# EAGLE design STorM32 NT BGC v620-sd-020 (EAGLE 7.5.0)
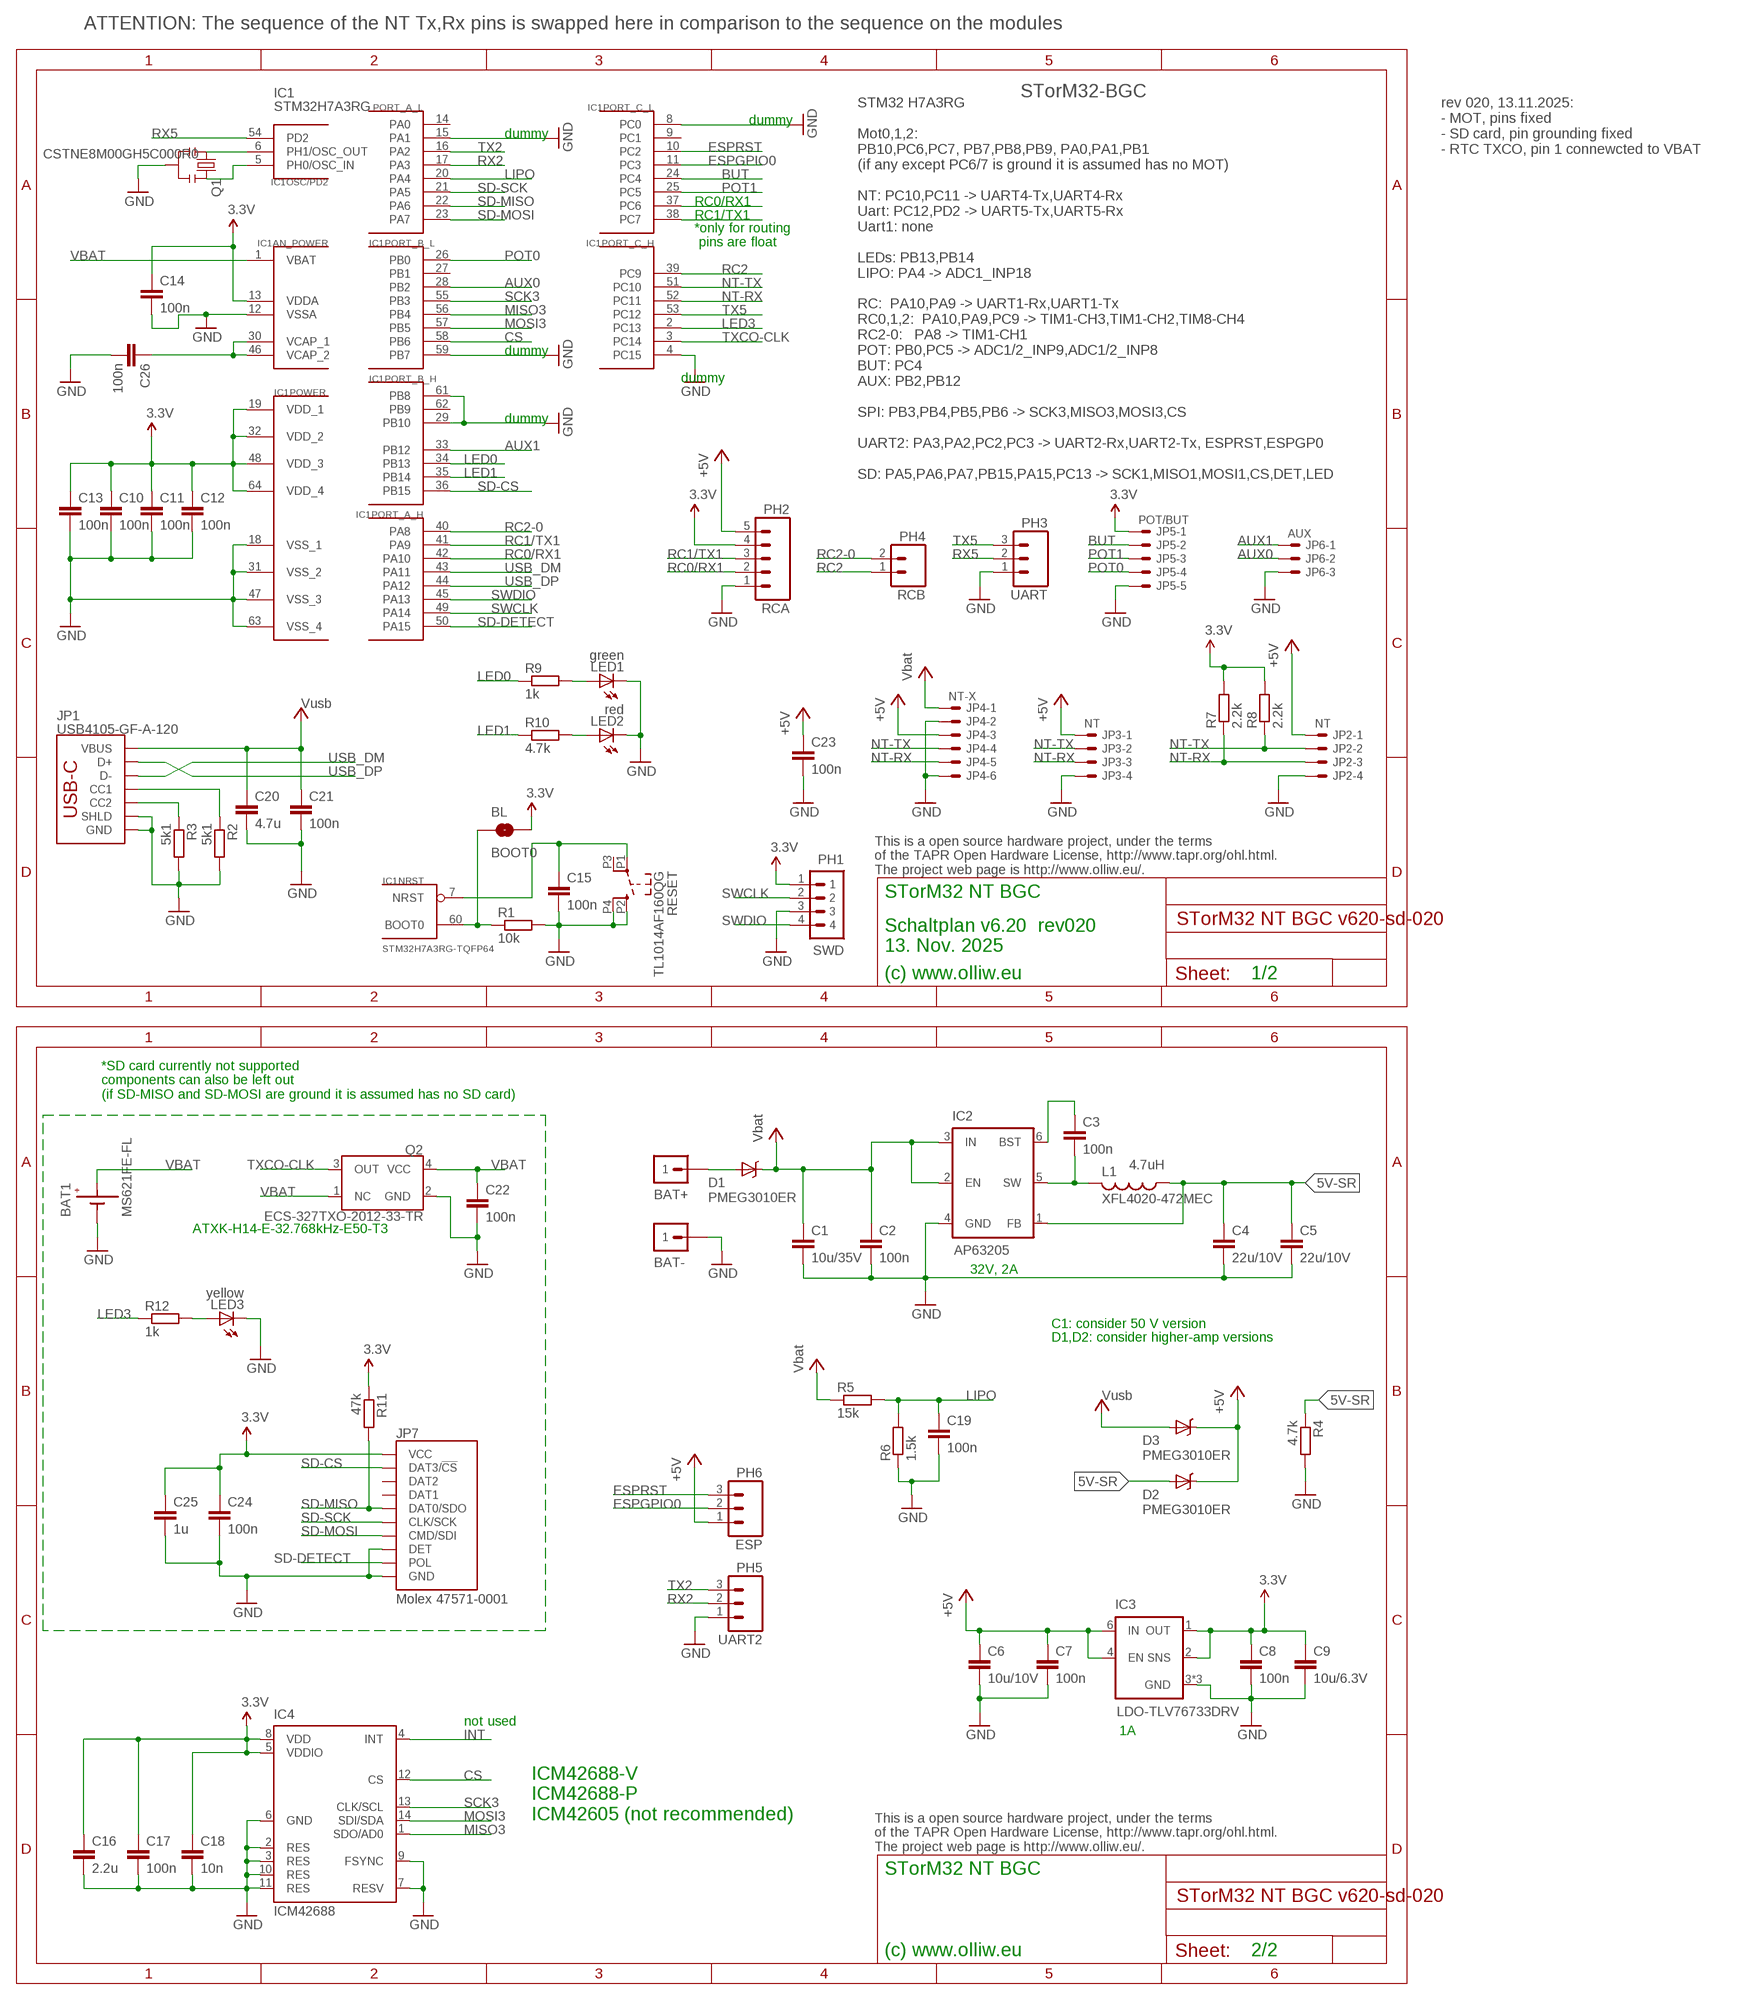
[diagram p0: schematic, sheet 1]

## Parts
BAT1  MS621FE-FL  CELL-SMD-6P8  [CELL-RECHARGABLE-6P8]
BAT+  M1X1  [1X1_WITHOUT]
BAT-  M1X1  [1X1_WITHOUT]
BL  BOOT0  SOLDERJUMPERNO  [SJ_2S-NO]
C1  10u/35V  C-EUC1206K  [C1206K]
C2  100n  C-EUC0603  [C0603]
C3  100n  C-EUC0402  [C0402]
C4  22u/10V  C-EUC0805K  [C0805K]
C5  22u/10V  C-EUC0805K  [C0805K]
C6  10u/10V  C-EUC0805K  [C0805K]
C7  100n  C-EUC0402  [C0402]
C8  100n  C-EUC0402  [C0402]
C9  10u/6.3V  C-EUC0805K  [C0805K]
C10  100n  C-EUC0402  [C0402]
C11  100n  C-EUC0402  [C0402]
C12  100n  C-EUC0402  [C0402]
C13  100n  C-EUC0402  [C0402]
C14  100n  C-EUC0402  [C0402]
C15  100n  C-EUC0402  [C0402]
C16  2.2u  C-EUC0603  [C0603]
C17  100n  C-EUC0402  [C0402]
C18  10n  C-EUC0402  [C0402]
C19  100n  C-EUC0402  [C0402]
C20  4.7u  C-EUC0603  [C0603]
C21  100n  C-EUC0402  [C0402]
C22  100n  C-EUC0402  [C0402]
C23  100n  C-EUC0402  [C0402]
C24  100n  C-EUC0402  [C0402]
C25  1u  C-EUC0402  [C0402]
C26  100n  C-EUC0402  [C0402]
D1  PMEG3010ER  DIODE-SCHOTTKYSOD123-W  [SOD123W-DIODE]
D2  PMEG3010ER  DIODE-SCHOTTKYSOD123-W  [SOD123W-DIODE]
D3  PMEG3010ER  DIODE-SCHOTTKYSOD123-W  [SOD123W-DIODE]
IC1  STM32H7A3RG-TQFP64  STM32H7A3-TQFP64  [TQFP64]
IC2  AP63205  [SOT23-6]
IC3  LDO-TLV76733DRV  LDO-TLV767  [WSON-6-2X2]
IC4  ICM42688  ICM42605  [LGA14-2.5X3]
JP1  USB4105-GF-A-120  USB-C  [USB-C]
JP2  NT  SM04B-SRSS-TB  [SM04B-SRSS-TB]
JP3  NT  SM04B-SRSS-TB  [SM04B-SRSS-TB]
JP4  NT-X  SM06B-SRSS-TB  [SM06B-SRSS-TB]
JP5  POT/BUT  SM05B-SRSS-TB  [SM05B-SRSS-TB]
JP6  AUX  SM03B-SRSS-TB  [SM03B-SRSS-TB]
JP7  Molex 47571-0001  SD-MICRO-DFT  [SD-MICRO-SHORT]
L1  XFL4020-472MEC  L  [L4X4]
LED1  green  LEDCHIPLED_0603  [CHIPLED_0603]
LED2  red  LEDCHIPLED_0603  [CHIPLED_0603]
LED3  yellow  LEDCHIPLED_0603  [CHIPLED_0603]
PH1  SWD  P4X1_1P27-OCT_BILEX  [4X1_1P27_OCT_BILEX]
PH2  RCA  M05PTH  [1X05]
PH3  UART  M031X03_NO_SILK  [1X03_NO_SILK]
PH4  RCB  M021X02_NO_SILK  [1X02_NO_SILK]
PH5  UART2  M031X03_NO_SILK  [1X03_NO_SILK]
PH6  ESP  M031X03_NO_SILK  [1X03_NO_SILK]
Q1  CSTNE8M00GH5C000R0  RESONATORSMD  [RESONATOR-SMD]
Q2  ECS-327TXO-2012-33-TR  TXCO-2.0X1.2MM  [TXCO-20X12]
R1  10k  R-EU_R0402  [R0402]
R2  5k1  R-EU_R0402  [R0402]
R3  5k1  R-EU_R0402  [R0402]
R4  4.7k  R-EU_R0402  [R0402]
R5  15k  R-EU_R0402  [R0402]
R6  1.5k  R-EU_R0402  [R0402]
R7  2.2k  R-EU_R0402  [R0402]
R8  2.2k  R-EU_R0402  [R0402]
R9  1k  R-EU_R0402  [R0402]
R10  4.7k  R-EU_R0402  [R0402]
R11  47k  R-EU_R0402  [R0402]
R12  1k  R-EU_R0402  [R0402]
RESET  TL1014AF160QG  SWITCH-SMD-RIGHT-TL1014  [TACTILE-SWITCH-SMD-RIGHT-TL1014]

## Nets
3.3V: BL.2 C8.1 C9.1 C10.1 C11.1 C12.1 C13.1 C14.1 C16.1 C17.1 C18.1 C24.1 C25.1 IC1.13(AN_POWER:VDDA) IC1.19(POWER:VDD_1) IC1.32(POWER:VDD_2) IC1.48(POWER:VDD_3) IC1.64(POWER:VDD_4) IC3.1(OUT) IC3.2(SNS) IC4.5(VDDIO) IC4.8(VDD) JP5.1 JP7.4(VCC) PH1.1 PH2.4 R7.2 R8.2 R11.1
5V-SR: C4.1 C5.1 D2.A IC2.1(FB) L1.1 R4.1
+5V: C6.1 C7.1 C23.1 D2.C D3.C IC3.4(EN) IC3.6(IN) JP2.1 JP3.1 JP4.3 PH2.5 PH6.1
AUX0: IC1.28(PORT_B_L:PB2) JP6.2
AUX1: IC1.33(PORT_B_H:PB12) JP6.1
BATP: BAT+.1 D1.A
BOOT0: BL.1 IC1.60(NRST:BOOT0) R1.1
BUT: IC1.24(PORT_C_L:PC4) JP5.2
CS: IC1.58(PORT_B_L:PB6) IC4.12(CS)
ESPGPIO0: IC1.11(PORT_C_L:PC3) PH6.2
ESPRST: IC1.10(PORT_C_L:PC2) PH6.3
GND: BAT1.P-(GND) BAT-.1 C1.2 C2.2 C4.2 C5.2 C6.2 C7.2 C8.2 C9.2 C10.2 C11.2 C12.2 C13.2 C14.2 C15.2 C16.2 C17.2 C18.2 C19.2 C20.2 C21.2 C22.2 C23.2 C24.2 C25.2 C26.2 IC1.4(PORT_C_H:PC15) IC1.8(PORT_C_L:PC0) IC1.12(AN_POWER:VSSA) IC1.15(PORT_A_L:PA1) IC1.18(POWER:VSS_1) IC1.29(PORT_B_H:PB10) IC1.31(POWER:VSS_2) IC1.47(POWER:VSS_3) IC1.59(PORT_B_L:PB7) IC1.61(PORT_B_H:PB8) IC1.63(POWER:VSS_4) IC2.4(GND) IC3.3(GND) IC3.5(GND) IC3.7(GND) IC4.2(RES) IC4.3(RES) IC4.6(GND) IC4.7(RESV) IC4.9(FSYNC) IC4.10(RES) IC4.11(RES) JP1.GND JP1.GND2(GND) JP1.SHLD1(SHLD) JP1.SHLD2(SHLD) JP1.SHLD3(SHLD) JP1.SHLD4(SHLD) JP2.4 JP3.4 JP4.2 JP4.6 JP5.5 JP6.3 JP7.6(GND) JP7.G4(DET) JP7.GND1(GND) JP7.GND2(GND) LED1.C LED2.C LED3.C PH1.3 PH2.1 PH3.1 PH5.1 Q1.2 Q2.2(GND) R1.2 R2.2 R3.2 R4.2 R6.1 RESET.P2 RESET.P4
INT: IC4.4(INT)
LED0: IC1.34(PORT_B_H:PB13) R9.1
LED1: IC1.35(PORT_B_H:PB14) R10.1
LED3: IC1.2(PORT_C_H:PC13) R12.1
LIPO: C19.1 IC1.20(PORT_A_L:PA4) R5.2 R6.2
MISO3: IC1.56(PORT_B_L:PB4) IC4.1(SDO/AD0)
MOSI3: IC1.57(PORT_B_L:PB5) IC4.14(SDI/SDA)
N$3: IC1.5(OSC/PD2:PH0/OSC_IN) Q1.3
N$4: LED3.A R12.2
N$8: LED1.A R9.2
N$9: LED2.A R10.2
N$10: JP1.A5(CC1) R2.1
N$11: JP1.B5(CC2) R3.1
N$12: IC1.6(OSC/PD2:PH1/OSC_OUT) Q1.1
N$13: C3.1 IC2.6(BST)
N$15: C3.2 IC2.5(SW) L1.2
NRST: C15.1 IC1.7(NRST:NRST) RESET.P1
NT-RX: IC1.52(PORT_C_H:PC11) JP2.3 JP3.3 JP4.5 R7.1
NT-TX: IC1.51(PORT_C_H:PC10) JP2.2 JP3.2 JP4.4 R8.1
POT0: IC1.26(PORT_B_L:PB0) JP5.4
POT1: IC1.25(PORT_C_L:PC5) JP5.3
RC0/RX1: IC1.37(PORT_C_L:PC6) IC1.42(PORT_A_H:PA10) PH2.2
RC1/TX1: IC1.38(PORT_C_L:PC7) IC1.41(PORT_A_H:PA9) PH2.3
RC2: IC1.39(PORT_C_H:PC9) PH4.1
RC2-0: IC1.40(PORT_A_H:PA8) PH4.2
RX2: IC1.17(PORT_A_L:PA3) PH5.2
RX5: IC1.54(OSC/PD2:PD2) PH3.2
SCK3: IC1.55(PORT_B_L:PB3) IC4.13(CLK/SCL)
SD-CS: IC1.36(PORT_B_H:PB15) JP7.2(DAT3/!CS!)
SD-DETECT: IC1.50(PORT_A_H:PA15) JP7.G3(POL)
SD-MISO: IC1.22(PORT_A_L:PA6) JP7.7(DAT0/SDO) R11.2
SD-MOSI: IC1.23(PORT_A_L:PA7) JP7.3(CMD/SDI)
SD-SCK: IC1.21(PORT_A_L:PA5) JP7.5(CLK/SCK)
SWCLK: IC1.49(PORT_A_H:PA14) PH1.2
SWDIO: IC1.45(PORT_A_H:PA13) PH1.4
TX2: IC1.16(PORT_A_L:PA2) PH5.3
TX5: IC1.53(PORT_C_H:PC12) PH3.3
TXCO-CLK: IC1.3(PORT_C_H:PC14) Q2.3(OUT)
USB_DM: IC1.43(PORT_A_H:PA11) JP1.A7(D-) JP1.B7(D-)
USB_DP: IC1.44(PORT_A_H:PA12) JP1.A6(D+) JP1.B6(D+)
VBAT: BAT1.P+(BAT+) C22.1 IC1.1(AN_POWER:VBAT) Q2.1(NC) Q2.4(VCC)
VCAP_1: C26.1 IC1.30(AN_POWER:VCAP_1) IC1.46(AN_POWER:VCAP_2)
VCC: C1.1 C2.1 D1.C IC2.2(EN) IC2.3(IN) JP4.1 R5.1 ; supply symbol labelled Vbat
VUSB: C20.1 C21.1 D3.A JP1.VBUS1(VBUS) JP1.VBUS2(VBUS) ; supply symbol labelled Vusb
Unconnected: IC1.9(PORT_C_L:PC1) IC1.14(PORT_A_L:PA0) IC1.27(PORT_B_L:PB1) IC1.62(PORT_B_H:PB9) JP7.1(DAT2) JP7.8(DAT1) RESET.P3

## Notes on the sheet
- ATTENTION: The sequence of the NT Tx,Rx pins is swapped here in comparison to the sequence on the modules
- IC1
- STM32 H7A3RG
  
  Mot0,1,2:
  PB10,PC6,PC7, PB7,PB8,PB9, PA0,PA1,PB1
  (if any except PC6/7 is ground it is assumed has no MOT)
  
  NT: PC10,PC11 -> UART4-Tx,UART4-Rx
  Uart: PC12,PD2 -> UART5-Tx,UART5-Rx
  Uart1: none
  
  LEDs: PB13,PB14
  LIPO: PA4 -> ADC1_INP18
  
  RC:  PA10,PA9 -> UART1-Rx,UART1-Tx
  RC0,1,2:  PA10,PA9,PC9 -> TIM1-CH3,TIM1-CH2,TIM8-CH4
  RC2-0:   PA8 -> TIM1-CH1
  POT: PB0,PC5 -> ADC1/2_INP9,ADC1/2_INP8
  BUT: PC4
  AUX: PB2,PB12
  
  SPI: PB3,PB4,PB5,PB6 -> SCK3,MISO3,MOSI3,CS
  
  UART2: PA3,PA2,PC2,PC3 -> UART2-Rx,UART2-Tx, ESPRST,ESPGP0
  
  SD: PA5,PA6,PA7,PB15,PA15,PC13 -> SCK1,MISO1,MOSI1,CS,DET,LED
- STorM32-BGC
- rev 020, 13.11.2025:
  - MOT, pins fixed
  - SD card, pin grounding fixed
  - RTC TXCO, pin 1 connewcted to VBAT
- STM32H7A3RG
- dummy
- dummy
- *only for routing
   pins are float
- dummy
- dummy
- dummy
- This is a open source hardware project, under the terms
  of the TAPR Open Hardware License, http://www.tapr.org/ohl.html.
  The project web page is http://www.olliw.eu/.
- STorM32 NT BGC
- Schaltplan v6.20  rev020
  13. Nov. 2025
- (c) www.olliw.eu | 1/2
- *SD card currently not supported
   components can also be left out
   (if SD-MISO and SD-MOSI are ground it is assumed has no SD card)
- 4.7uH
- ATXK-H14-E-32.768kHz-E50-T3
- 32V, 2A
- C1: consider 50 V version
- D1,D2: consider higher-amp versions
- not used | 1A
- ICM42688-V
  ICM42688-P
  ICM42605 (not recommended)
- This is a open source hardware project, under the terms
  of the TAPR Open Hardware License, http://www.tapr.org/ohl.html.
  The project web page is http://www.olliw.eu/.
- STorM32 NT BGC
- (c) www.olliw.eu | 2/2

## Library data of the parts
BAT1 = # stdlib:CELL
BAT+ BAT- = # stdlib:M1X1
BL = # SparkFun2:SOLDERJUMPER: Solder Jumper Standard SMD solder jumper. Used to automate production. Two varients : Normally Open and Normally Closed are the same, but have different paste layers. NC will have a large amount of paste and should jumper during reflow.
C1-C26 = rcl:C-EU: CAPACITOR, European symbol
D1-D3 = # stdlib:DIODE-SCHOTTKY
IC1 = # stm32:STM32H7A3
IC2 = # stdlib:AP63205
IC3 = # stdlib:LDO-TLV767
IC4 = # stdlib:ICM42605
JP1 = # stdlib:USB
JP2 JP3 = con-jst2:?M04B-SRSS-TB: Disconnectable Crimp style connector, 1.0mm pitch 4 contacts
JP4 = con-jst2:?M06B-SRSS-TB: Disconnectable Crimp style connector, 1.0mm pitch 6 contacts
JP5 = con-jst2:?M05B-SRSS-TB: Disconnectable Crimp style connector, 1.0mm pitch 5 contacts
JP6 = con-jst2:?M03B-SRSS-TB: Disconnectable Crimp style connector, 1.0mm pitch 3 contacts
JP7 = # stdlib:SD-MICRO
L1 = # stdlib:L
LED1-LED3 = led:LED: LED OSRAM: - CHIPLED LG R971, LG N971, LY N971, LG Q971, LY Q971, LO R971, LY R971 LH N974, LH R974 LS Q976, LO Q976, LY Q976 LO Q996 - Hyper CHIPLED LW Q18S LB Q993, LB Q99A, LB R99A - SideLED LS A670, LO A670, LY A670, LG A670, LP A670 LB A673, LV A673, LT A673, LW A673 LH A674 LY A675 LS A676, LA A676, LO A676, LY A676, LW A676 LS A679, LY A679, LG A679 - Hyper Micro SIDELED® LS Y876, LA Y876, LO Y876, LY Y876 LT Y87S - SmartLED LW L88C, LW L88S LB L89C, LB L89S, LG L890 LS L89K, LO L89K, LY L89K LS L896, LA L896, LO L896, LY L896 - TOPLED LS T670, LO T670, LY T670, LG T670, LP T670 LSG T670, LSP T670, LSY T670, LOP T670, LYG T670 LG T671, LOG T671, LSG T671 LB T673, LV T673, LT T673, LW T673 LH T674 LS T676, LA T676, LO T676, LY T676, LB T676, LH T676, LSB T676, LW T676 LB T67C, LV T67C, LT T67C, LS T67K, LO T67K, LY T67K, LW E67C LS E67B, LA E67B, LO E67B, LY E67B, LB E67C, LV E67C, LT E67C LW T67C LS T679, LY T679, LG T679 LS T770, LO T770, LY T770, LG T770, LP T770 LB T773, LV T773, LT T773, LW T773 LH T774 LS E675, LA E675, LY E675, LS T675 LS T776, LA T776, LO T776, LY T776, LB T776 LHGB T686 LT T68C, LB T68C - Hyper Mini TOPLED® LB M676 - Mini TOPLED Santana® LG M470 LS M47K, LO M47K, LY M47K Source: http://www.osram.convergy.de LUXEON: - LUMILED® LXK2-PW12-R00, LXK2-PW12-S00, LXK2-PW14-U00, LXK2-PW14-V00 LXK2-PM12-R00, LXK2-PM12-S00, LXK2-PM14-U00 LXK2-PE12-Q00, LXK2-PE12-R00, LXK2-PE12-S00, LXK2-PE14-T00, LXK2-PE14-U00 LXK2-PB12-K00, LXK2-PB12-L00, LXK2-PB12-M00, LXK2-PB14-N00, LXK2-PB14-P00, LXK2-PB14-Q00 LXK2-PR12-L00, LXK2-PR12-M00, LXK2-PR14-Q00, LXK2-PR14-R00 LXK2-PD12-Q00, LXK2-PD12-R00, LXK2-PD12-S00 LXK2-PH12-R00, LXK2-PH12-S00 LXK2-PL12-P00, LXK2-PL12-Q00, LXK2-PL12-R00 Source: www.luxeon.com KINGBRIGHT: KA-3528ASYC Source: www.kingbright.com
PH1 = # stdlib:P4X1_1P27
PH2 = # SparkFun2:M05: Header 5 Standard 5-pin 0.1" header. Use with straight break away headers (SKU : PRT-00116), right angle break away headers (PRT-00553), swiss pins (PRT-00743), machine pins (PRT-00117), and female headers (PRT-00115). Molex polarized connector foot print use with SKU : PRT-08230 with associated crimp pins and housings.
PH3 PH5 PH6 = # SparkFun2:M03: Header 3 Standard 3-pin 0.1" header. Use with straight break away headers (SKU : PRT-00116), right angle break away headers (PRT-00553), swiss pins (PRT-00743), machine pins (PRT-00117), and female headers (PRT-00115). Molex polarized connector foot print use with SKU : PRT-08232 with associated crimp pins and housings.
PH4 = # SparkFun2:M02: Header 2 Standard 2-pin 0.1" header. Use with straight break away headers (SKU : PRT-00116), right angle break away headers (PRT-00553), swiss pins (PRT-00743), machine pins (PRT-00117), and female headers (PRT-00115). Molex polarized connector foot print use with SKU : PRT-08233 with associated crimp pins and housings.
Q1 = # SparkFun2:RESONATOR: Resonator Small SMD resonator. This is the itty bitty 10/20MHz resonators with built in caps. CSTCE10M0G55 and CSTCE20M0V53. Footprint has been reviewed closely but hasn't been tested yet.
Q2 = # stdlib:TXCO
R1-R12 = rcl:R-EU_: RESISTOR, European symbol
RESET = # stdlib:SWITCH-SMD-RIGHT-TL1014

## Board
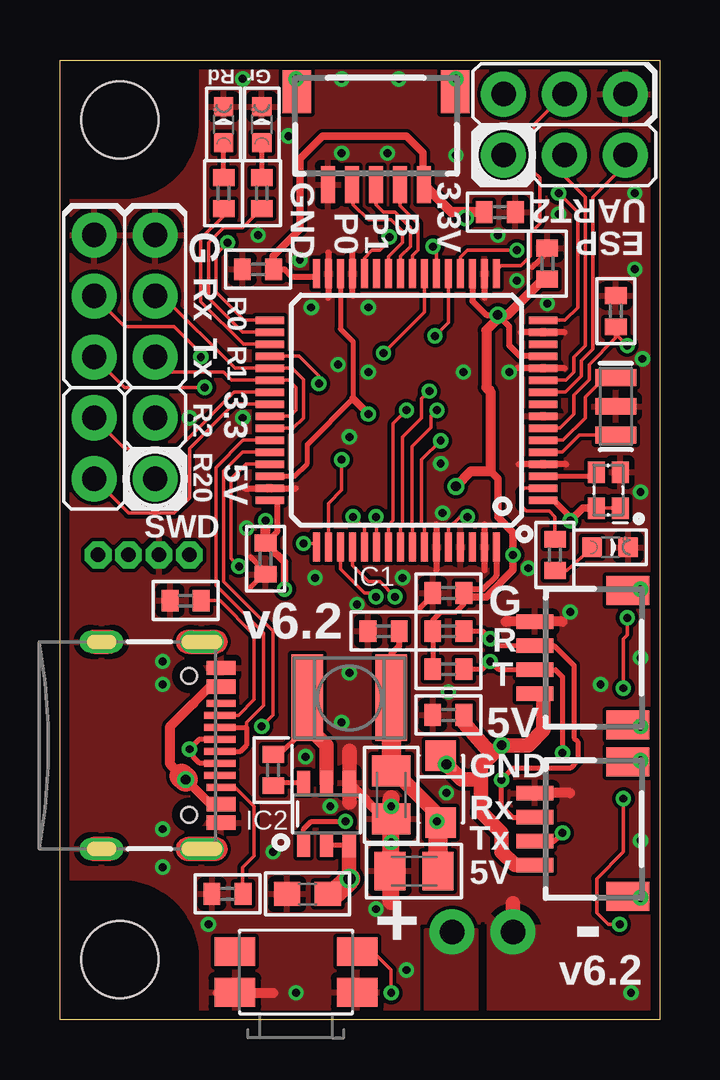
[diagram p1: board, top side]
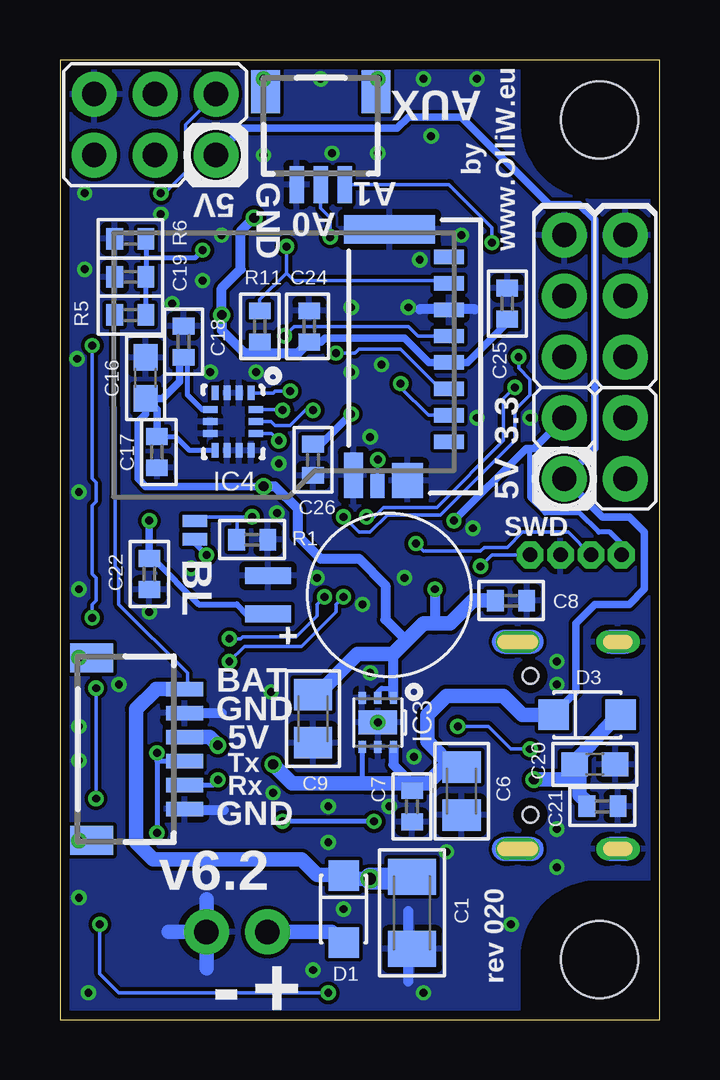
[diagram p2: board, bottom side, seen from below]

Size 25 x 40 mm. Coordinates in mm from the lower left corner, seen from the top.
Outline: 25,0 0,0 0,40 25,40 25,0
Copper layers (1*16): Top 0.035mm / dielectric 1.5mm / Bottom 0.035mm
Design rules "ShenZhen2U_2layer_EagleRules *": minimum track width 6mil, minimum drill 12mil, track to track 6mil, track to pad 6mil, pad to pad 6mil, via to via 6mil, smd to smd 0mil, copper to edge 15mil, drill to drill 10mil, minimum pad ring 10mil, minimum via ring 6mil, stop-mask expansion 2mil, vias tented up to drill 25mil, thermal gap 10mil
Holes 3.2 mm at 2.5,2.5 2.5,37.5
tRestrict: area 17.7,0.3 to 17.8,4

### Footprints (pad centres in the part's own frame; a part is rotated, then mirrored left to right if it is on the bottom)
CELL-RECHARGABLE-6P8 = smd 1.9 x 0.7: P+ 5.05,0.8; P- 5.05,-0.8
1X1_WITHOUT = drill 1.016 pad 1.88: 1 0,0
SJ_2S-NO = smd 0.508 x 1.016: 1 -0.381,0; 2 0.381,0
C1206K = smd 1.5 x 2: 1 -1.5,0; 2 1.5,0
C0603 = smd 1.1 x 1: 1 -0.85,0; 2 0.85,0
C0402 = smd 0.7 x 0.9: 1 -0.65,0; 2 0.65,0
C0805K = smd 1.3 x 1.6: 1 -1,0; 2 1,0
SOD123W-DIODE = smd 1.27 x 1.27: A -1.4,0; C 1.4,0
TQFP64 = smd 1.2 x 0.3: 1 -5.7,3.75; 2 -5.7,3.25; 3 -5.7,2.75; 4 -5.7,2.25; 5 -5.7,1.75; 6 -5.7,1.25; 7 -5.7,0.75; 8 -5.7,0.25; 9 -5.7,-0.25; 10 -5.7,-0.75; 11 -5.7,-1.25; 12 -5.7,-1.75; 13 -5.7,-2.25; 14 -5.7,-2.75; 15 -5.7,-3.25; 16 -5.7,-3.75; 33 5.7,-3.75; 34 5.7,-3.25; 35 5.7,-2.75; 36 5.7,-2.25; 37 5.7,-1.75; 38 5.7,-1.25; 39 5.7,-0.75; 40 5.7,-0.25; 41 5.7,0.25; 42 5.7,0.75; 43 5.7,1.25; 44 5.7,1.75; 45 5.7,2.25; 46 5.7,2.75; 47 5.7,3.25; 48 5.7,3.75 | smd 0.3 x 1.2: 17 -3.75,-5.7; 18 -3.25,-5.7; 19 -2.75,-5.7; 20 -2.25,-5.7; 21 -1.75,-5.7; 22 -1.25,-5.7; 23 -0.75,-5.7; 24 -0.25,-5.7; 25 0.25,-5.7; 26 0.75,-5.7; 27 1.25,-5.7; 28 1.75,-5.7; 29 2.25,-5.7; 30 2.75,-5.7; 31 3.25,-5.7; 32 3.75,-5.7; 49 3.75,5.7; 50 3.25,5.7; 51 2.75,5.7; 52 2.25,5.7; 53 1.75,5.7; 54 1.25,5.7; 55 0.75,5.7; 56 0.25,5.7; 57 -0.25,5.7; 58 -0.75,5.7; 59 -1.25,5.7; 60 -1.75,5.7; 61 -2.25,5.7; 62 -2.75,5.7; 63 -3.25,5.7; 64 -3.75,5.7
SOT23-6 = smd 0.55 x 0.99: 1 -0.95,-1.3; 2 0,-1.3; 3 0.95,-1.3; 4 0.95,1.3; 5 0,1.3; 6 -0.95,1.3
WSON-6-2X2 = smd 0.5 x 0.3: 1 -1.025,0.65; 2 -1.025,0; 3 -1.025,-0.65; 4 1.025,-0.65; 5 1.025,0; 6 1.025,0.65 | smd 1 x 1.6: 7 0,0
LGA14-2.5X3 = smd 0.6 x 0.3: 1 -1.2,0.75; 2 -1.2,0.25; 3 -1.2,-0.25; 4 -1.2,-0.75; 8 1.2,-0.75; 9 1.2,-0.25; 10 1.2,0.25; 11 1.2,0.75 | smd 0.3 x 0.6: 5 -0.5,-0.95; 6 0,-0.95; 7 0.5,-0.95; 12 0.5,0.95; 13 0,0.95; 14 -0.5,0.95
USB-C = smd 0.3 x 1.3: A5 -1.25,3.65; A6 -0.25,3.65; A7 0.25,3.65; A8 1.25,3.65; B6 0.75,3.65; B7 -0.75,3.65 | smd 0.3 x 1.2: B5 1.75,3.7; B8 -1.75,3.7 | smd 0.6 x 1.2: GND -3.225,3.7; GND2 3.225,3.7; VBUS1 -2.45,3.7; VBUS2 2.45,3.7 | drill 0.4 pad 0.6 long: SHLD1 -4.318,2.895; SHLD2 4.318,2.895; SHLD3 -4.318,-1.285; SHLD4 4.318,-1.285 | hole 0.65: -2.89,2.365; 2.89,2.365
SM04B-SRSS-TB = smd 0.6 x 1.55: 1 -1.5,2.975; 2 -0.5,2.975; 3 0.5,2.975; 4 1.5,2.975 | smd 1.2 x 1.8: FIT@1 -2.8,-0.9; FIT@2 2.8,-0.9
SM06B-SRSS-TB = smd 0.6 x 1.55: 1 -2.5,2.975; 2 -1.5,2.975; 3 -0.5,2.975; 4 0.5,2.975; 5 1.5,2.975; 6 2.5,2.975 | smd 1.2 x 1.8: FIT@1 -3.8,-0.9; FIT@2 3.8,-0.9
SM05B-SRSS-TB = smd 0.6 x 1.55: 1 -2,2.975; 2 -1,2.975; 3 0,2.975; 4 1,2.975; 5 2,2.975 | smd 1.2 x 1.8: FIT@1 -3.3,-0.9; FIT@2 3.3,-0.9
SM03B-SRSS-TB = smd 0.6 x 1.55: 1 -1,2.975; 2 0,2.975; 3 1,2.975 | smd 1.2 x 1.8: FIT@1 -2.3,-0.9; FIT@2 2.3,-0.9
SD-MICRO-SHORT = smd 0.6 x 1.25: 1 3.85,-1.325; 2 2.75,-1.325; 3 1.65,-1.325; 4 0.55,-1.325; 5 -0.55,-1.325; 6 -1.65,-1.325; 7 -2.75,-1.325; 8 -3.85,-1.325 | smd 1 x 0.6: G3 5.7,-4.3 | smd 1.9 x 0.8: G4 5.25,-5.3 | smd 1.2 x 3.8: GND1 -5,-3.8 | smd 1.45 x 1.3: GND2 5.475,-3.05
L4X4 = smd 1.3 x 3.6: 1 -1.75,0; 2 1.75,0
CHIPLED_0603 = smd 0.8 x 0.8: A 0,-0.75; C 0,0.75
4X1_1P27_OCT_BILEX = drill 0.61 pad 1.118 octagon: 1 0,0; 2 0,-1.27; 3 0,-2.54; 4 0,-3.81
1X05 = drill 1.016 pad 1.88: 1 0,0; 2 2.54,0; 3 5.08,0; 4 7.62,0; 5 10.16,0
1X03_NO_SILK = drill 1.016 pad 1.88: 1 0,0; 2 2.54,0; 3 5.08,0
1X02_NO_SILK = drill 1.016 pad 1.88: 1 0,0; 2 2.54,0
RESONATOR-SMD = smd 0.7 x 1.7: 1 -1.2,0; 2 0,0; 3 1.2,0
TXCO-20X12 = smd 0.7 x 0.9: 1 -0.5,0.75; 2 -0.5,-0.75; 3 0.5,-0.75; 4 0.5,0.75
R0402 = smd 0.7 x 0.9: 1 -0.65,0; 2 0.65,0
TACTILE-SWITCH-SMD-RIGHT-TL1014 = smd 1.7 x 1.2: P1 2.55,0.85; P2 2.55,-0.85; P3 -2.55,0.85; P4 -2.55,-0.85

### Placement (x,y rotation side)
BAT1  11.27,17.7 180 bottom
BAT+  16.35,3.65 90 top
BAT-  18.89,3.65 0 top
BL  19.37,20.4 270 bottom
C1  10.32,4.45 270 bottom
C2  10.32,5.24 180 top
C3  8.89,10.4 90 top
C4  14.76,6.19 180 top
C5  13.81,9.37 270 top
C6  8.26,9.53 270 bottom
C7  10.32,8.89 270 bottom
C8  6.19,17.46 0 bottom
C9  14.45,12.54 270 bottom
C10  16.19,17.78 180 top
C11  8.26,31.27 180 top
C12  8.57,19.21 270 top
C13  20.32,31.51 90 top
C14  18.34,33.66 0 top
C15  23.18,29.53 90 top
C16  21.43,26.75 90 bottom
C17  20.95,23.65 270 bottom
C18  19.84,28.26 90 bottom
C19  22.07,30.96 180 bottom
C20  2.7,10.64 0 bottom
C21  2.38,8.89 0 bottom
C22  21.27,18.57 270 bottom
C23  16.19,12.7 180 top
C24  14.6,28.89 90 bottom
C25  6.35,29.84 90 bottom
C26  14.45,23.34 270 bottom
D1  13.18,4.6 90 bottom
D2  15.87,9.6 90 top
D3  3.02,12.7 180 bottom
IC1  14.45,25.4 180 top
IC2  11.11,8.57 0 top
IC3  11.75,12.38 270 bottom
IC4  17.78,24.92 270 bottom
JP1  3.02,11.43 270 top
JP2  22.78,7.94 90 top
JP3  22.78,15.08 90 top
JP4  22.78,11.27 270 bottom
JP5  13.18,37.78 180 top
JP6  14.13,37.78 180 bottom
JP7  7.46,27.94 270 bottom
L1  12.06,13.41 180 top
LED1  8.41,37.31 0 top
LED2  6.83,37.31 0 top
LED3  22.94,19.68 270 top
PH1  1.59,19.37 90 top
PH2  3.97,32.7 270 top
PH3  1.43,32.7 270 top
PH4  1.43,25.08 270 top
PH5  23.57,38.58 180 top
PH6  18.49,36.04 0 top
Q1  23.18,25.56 270 top
Q2  22.86,22.07 180 top
R1  16.99,20 0 bottom
R2  5.24,17.46 180 top
R3  6.98,5.24 180 top
R4  13.49,16.19 180 top
R5  22.07,29.37 0 bottom
R6  22.07,32.54 0 bottom
R7  16.19,16.19 180 top
R8  16.19,14.61 180 top
R9  8.41,34.45 90 top
R10  6.83,34.45 90 top
R11  16.67,28.89 90 bottom
R12  20.64,19.37 270 top
RESET  9.84,1.98 0 top

### Tracks (layer width: path | path; a pad name or v marks a point on that pad's centre or on a via)
3.3V  (via drill 0.33, 0.4)
  Top 0.152: 15.15,34.87 JP5.1 | IC1.48 8.88,21.65 9.05,21.64
  Top 0.203: R8.2 R7.2 15.54,16.65 15.87,16.99 16.51,16.99 16.84,17.32 C10.1 | C11.1 8.9,31.42 8.89,31.43
  Top 0.254: 8.89,31.43 8.89,31.29 C11.1 9.37,31.27 9.68,30.96 10.7,30.96 IC1.32 | 9.05,21.64 9.05,20.32 8.57,19.84 | C10.1 16.84,17.8 16.99,17.94 17.64,17.94 18.2,18.5 IC1.64 | IC1.19 17.2,29.95 17.78,29.37 v18.26,29.37 18.73,28.89 18.73,28.1 19.18,27.65 IC1.13
  Top 0.305: 15.15,34.87 15.15,36.13 14.45,36.83 10.95,36.83 10,35.88 10,32.94 8.89,31.83 8.89,31.43 | 17.94,22.86 18.26,22.54 18.26,20.94 18.89,20.3 v18.89,19.37 18.89,18.73 17.78,17.62 17,17.62 C10.1 | v9.37,17.94 9.37,19.07 8.75,19.68 8.57,19.84 C12.1
  Top 0.406: v16.51,22.23 17.15,22.86 17.94,22.86 17.94,26.19 17.78,26.35 17.78,28.73 18.26,29.21 v18.26,29.37 18.65,29.37 20.15,30.86 C13.1 | C14.1 16.91,33.66 | 16.91,33.66 16.33,33.66 JP5.1 | v16.91,33.42 16.91,33.66 | C12.1 v8.57,20.8
  Bottom 0.203: IC4.8 19.6,23.72 20.16,24.29 20.78,24.29 C17.1 | IC4.5 19.07,25.42 19.69,26.04 19.69,27.45 C18.1 | PH1.1 1.59,19.84 2.06,20.32 2.54,20.32 3.33,21.11 4.76,21.11 5.4,21.75 5.4,23.81 | BL.2 19.53,20 v18.89,19.37 | IC3.2 11.75,13.65 11.59,13.81 11.26,13.81 11.1,13.97 | R11.1 16.83,27.78
  Bottom 0.305: v16.51,22.23 21.43,22.23 21.75,22.54 21.75,24.92 21.43,25.24 C16.1 | 14.76,28.1 14.62,28.26 C24.1 14.12,28.24 13.95,28.42 10.64,28.42 9.61,27.39 JP7.4 8.01,27.39 6.35,29.05 C25.1 | C17.1 20.95,25.42 C16.1 | C18.1 20.02,27.61 20,27.3 20,26.59 20.72,25.88 21.38,25.88 C16.1 | PH2.4 5.24,23.81 5.4,23.81 5.56,23.81 v8.57,20.8
  Bottom 0.406: 14.76,28.1 15.08,27.78 16.83,27.78 17.3,27.78 18.26,28.73 v18.26,29.37 18.26,30.48 17.46,31.27 17.46,32.86 v16.91,33.42 | v16.51,22.23 16.03,22.23 15.08,21.27 15.08,20.16 14.13,19.21 12.54,19.21 11.43,18.1 11.43,16.67 10.56,15.8 | v9.37,17.94 9.37,16.51 | IC3.1 11.1,13.97 11.1,15.22 11.11,15.24
  Bottom 0.61: C8.1 7.78,17.46 8.73,16.51 9.37,16.51 9.84,16.51 10.56,15.8 11.11,15.24 12.59,15.24 14.29,13.54 C9.1
5V-SR  (via drill 0.33)
  Top 0.203: IC2.1 10.16,7.94 10.48,8.26 v11.91,8.26
  Top 0.254: R4.1 14.14,15.57 13.81,15.24 13.81,13.5 L1.1
  Top 0.406: 13.76,10.32 C5.1 | 15.76,8.21 15.92,8.08 D2.A
  Top 0.61: 15.76,8.21 v15.72,8.26 | 13.76,10.32 14.13,10.16 15.87,8.41 v15.72,8.26 | 15.72,8.1 v15.72,8.26 | C5.1
  Top 0.813: C4.1 15.76,8.21 | L1.1 C5.1
  Bottom 0.203: v11.91,8.26 v15.72,8.26
+5V  (via drill 0.4)
  Top 0.152: 19.71,6.44 JP2.1
  Top 0.406: JP3.1 20.07,13.58 20.16,13.49 | 17.49,10.53 17.54,10.48
  Top 0.61: 17.54,10 17.54,10.48 17.54,10.56 18.02,11.03 | 17.54,10 17.54,8.65 18.41,7.78 18.41,6.99 18.96,6.44 19.71,6.44 | 20.16,13.49 20.16,12.06 19.53,11.43 v18.41,11.43 18.02,11.03 | v16.11,10.64 D2.C 15.93,10.79 v16.11,10.64 | v16.11,10.64 16.75,10 17.54,10 | C23.1 16.84,12.37 18.02,11.03
  Bottom 0.203: IC3.4 12.4,10.02 12.22,9.84
  Bottom 0.305: PH6.1 17.38,37.15 10.95,37.15 10.48,37.62 8.26,37.62 4.6,33.97 3.33,33.97 2.7,33.34 2.7,23.81 PH2.5 2.38,20.95 1.27,20.95 0.63,20.32 0.63,17.94 1.27,17.3 2.7,17.3 3.49,16.51 3.49,13.65 4.42,12.73 D3.C
  Bottom 0.406: IC3.6 11.1,10.62 10.32,9.84
  Bottom 0.61: JP4.3 18.76,11.77 v18.41,11.43 | D3.C 5.71,12.7 6.51,13.49 8.89,13.49 9.68,12.7 9.68,11.59 8.57,10.48 | v16.11,10.64 15.32,9.84 12.22,9.84 10.32,9.84 | C6.1 8.41,10.64 | 10.32,9.84 9.68,9.84 9.05,10.48 8.57,10.48 | 8.57,10.48 8.46,10.48 C6.1 | 8.57,10.48 8.21,10.32 C6.1 | 10.32,9.84 C7.1
AUX0  (via drill 0.33)
  Top 0.152: IC1.28 12.7,31.75 13.02,32.07 13.33,32.07 13.73,32.46 v13.73,32.62
  Bottom 0.152: JP6.2 14.13,33.81 13.73,33.42 v13.73,32.62
AUX1  (via drill 0.33)
  Top 0.152: v6.98,32.38 6.51,31.91 6.51,30.32 7.68,29.15 IC1.33
  Bottom 0.152: JP6.1 8.77,34.81 6.98,33.02 v6.98,32.38
BATP
  Bottom 0.61: BAT+.1 13.68,3.65 D1.A
  pour Top (isolate 0.229, no thermals): 15.24,3.73 15.24,0.4 17.38,0.4 17.38,3.73
BOOT0  (via drill 0.33)
  Top 0.152: IC1.60 16.2,20.48 16.67,20.95 v16.99,20.95
  Bottom 0.152: 17.62,20.95 19.51,20.95 BL.1 | R1.1 17.62,20 17.62,20.95 | 17.62,20.95 v16.99,20.95
BUT
  Top 0.152: JP5.2 14.18,33.92 14.92,33.18 14.92,32.07 14.7,31.84 IC1.24
CS  (via drill 0.33)
  Top 0.152: v15.87,24.13 15.08,23.34 15.08,20.64 15.2,20.52 IC1.58
  Bottom 0.152: IC4.12 16.17,24.42 v15.87,24.13
ESPGPIO0
  Top 0.152: PH6.2 21.03,35.16 21.91,34.29 21.91,28.1 21.43,27.62 21.43,26.99 21.09,26.65 IC1.11
ESPRST
  Top 0.152: PH6.3 23.57,35.64 22.23,34.29 22.23,27.94 21.75,27.46 21.75,26.83 21.07,26.15 IC1.10
GND  (via drill 0.33)  (1 unrouted)
  Top 0.203: 7.94,19.29 8.49,18.73 | 7.94,18.02 8.49,18.57 | 14.92,17.07 15.48,17.62 | 19.69,31.35 20.24,31.91
  Top 0.254: 11.19,31.99 11.19,30.08 | 21.03,27.15 19.05,27.15 | 17.7,20.64 17.7,18.73 | 7.7,22.15 9.84,22.15 | 12.2,30.16 12.2,32.07 | 21.03,28.65 19.21,28.65 | 21.11,23.15 19.13,23.15 | 15.69,20.64 15.69,18.73 | 17.7,31.51 17.7,30.08
  Top 0.406: 11.75,1.11 12.46,1.11 | 6.59,1.11 8.89,1.11 | 20.95,16.59 18.57,16.59 | 21.27,9.45 19.37,9.45 | 13.49,8.41 12.06,9.84
  Top 0.61: BAT-.1 18.89,4.84 | 12.06,9.05 12.06,9.84 12.06,11.19
  Top 0.711: 13.81,4.92 13.81,9.21
  Bottom 0.406: 10.48,1.59 10.48,4.52 | 20.16,12.78 18.26,12.78 | 20.32,8.73 18.18,8.73 | 7.7,29.61 10,29.61
  Bottom 0.61: 18.89,5 18.89,2.14 | 18.26,3.65 20.48,3.65
  other vias: 14.13,39.21 10,31.67 7.62,39.21 12.86,29.69 10.48,29.69 11.59,27.3 12.86,26.99 15.87,23.18 15.95,21.11 14.29,18.41 4.29,13.97 4.29,14.92 4.29,7.94 4.29,6.35 6.19,3.97 9.84,1.11 22.54,13.97 24.21,12.22 24.21,10.79 24.21,5.08 24.21,17.94 24.21,7.46 24.21,15.08 23.97,31.27 23.97,34.45 16.51,36.04 16.51,39.21 11.75,39.21 9.84,39.21 16.83,26.99 20.32,29.84 12.06,24.29 12.06,14.45 11.75,12.38 8.89,6.99 11.27,8.89 10.24,10.95 13.81,8.89 13.18,4.6 16.19,13.65 21.27,16.99 10.64,18.41 14.45,2.06 23.81,1.11 13.81,7.38 12.38,17.3 19.53,18.81 19.05,30.8 18.73,26.99 7.78,20.48 24.21,21.99 20.8,33.58 18.26,32.7 8.26,32.7 9.53,36.83 5.4,25.08 7.62,25.08 24.29,27.54 13.65,36.12 11.75,36.12 16.11,9.45
  pour Top (isolate 0.152, rank 6): 5.87,-0.16 5.87,2.54 arc90 2.54,5.87 -0.63,5.87 -0.63,34.13 2.54,34.13 arc90 5.87,37.31 5.87,40.32 25.23,40.32 25.23,-0.16
  pour Bottom (isolate 0.152, rank 6): 5.87,-0.16 5.87,2.54 arc90 2.54,5.87 -0.63,5.87 -0.63,34.13 2.54,34.13 arc90 5.87,37.31 5.87,40.32 25.23,40.32 25.23,-0.16
  pour Top (no thermals): 20.08,3.89 20.08,0.4 17.78,0.4 17.78,4.13 17.46,4.13 17.15,4.6 17.7,4.6 18.41,3.89
LED0
  Top 0.152: R9.1 8.1,33.5 7.62,33.02 6.83,33.02 6.19,32.38 6.19,30.08 7.62,28.65 IC1.34
LED1
  Top 0.152: R10.1 6.83,33.5 5.87,32.54 5.87,29.92 7.65,28.15 IC1.35
LED3
  Top 0.152: IC1.2 19.37,22.15 19.21,21.99 19.21,21.43 19.45,21.19 20.4,21.19 20.64,20.95 R12.1
LIPO  (via drill 0.33)
  Top 0.152: v19.05,32.07 16.99,32.07 16.7,31.78 IC1.20
  Bottom 0.203: R6.2 21.42,31.75 | 21.42,31.75 C19.1 R5.2 | 21.42,31.75 19.37,31.75 v19.05,32.07
MISO3  (via drill 0.33)
  Top 0.152: v15.4,26.19 15.08,25.88 15.08,25.08 14.29,24.29 14.29,20.64 14.2,20.55 IC1.56
  Bottom 0.152: IC4.1 16.1,26.12 16.03,26.19 v15.4,26.19
MOSI3  (via drill 0.33)
  Top 0.152: v15.72,25.4 15.48,25.16 15.48,24.69 14.68,23.89 14.68,20.56 14.7,20.55 IC1.57
  Bottom 0.152: v15.72,25.4 15.87,25.4 15.74,25.42 IC4.14
N$3
  Top 0.152: IC1.5 20.95,23.65 21.66,24.36 Q1.3
N$4
  Top 0.152: R12.2 21.14,18.72 LED3.A
N$8
  Top 0.152: 8.43,36.85 LED1.A | 8.43,35.28 R9.2
  Top 0.203: 8.43,35.28 8.43,36.85
N$9
  Top 0.203: R10.2 LED2.A
N$10
  Top 0.152: JP1.A5 7.44,12.68 8.1,13.34 8.1,16.03 6.67,17.46 R2.1
N$11
  Top 0.152: JP1.B5 7.31,9.68 8.1,8.89 8.1,6.83 7.62,6.35 7.62,5.41 R3.1
N$12
  Top 0.152: Q1.1 22.7,26.75 21.91,25.96 21.91,25.08 20.98,24.15 IC1.6
N$13
  Top 0.203: IC2.6 9.08,9.87 9.05,9.84 8.98,9.84 C3.1
N$15
  Top 0.203: C3.2 9.14,11.05 10,11.91 10,12.54 10.32,12.86
  Top 0.61: IC2.5 11.11,11.43 10.32,12.22 10.32,12.86 L1.2
NRST  (via drill 0.33)
  Top 0.152: 12.88,2.9 RESET.P1 13.04,2.83 13.81,2.06 v13.81,1.11 | v23.65,16.75 23.65,16.03 23.49,15.88 v23.49,13.81 | v23.49,9.21 23.49,6.99 22.38,5.87 22.38,4.45 22.86,3.97 v23.34,3.97 | v23.65,28.1 23.18,28.57 C15.1 23.16,28.4 22.07,27.3 22.07,26.67 21.43,26.04 21.43,25.24 20.84,24.65 IC1.7
  Bottom 0.152: v13.81,1.11 22.54,1.11 23.34,1.91 v23.34,3.97 | v23.49,9.21 v23.49,13.81 | v23.65,16.75 23.65,17.3 23.49,17.46 23.49,18.41 23.65,18.57 23.65,21.43 23.49,21.59 23.49,22.38 23.65,22.54 v23.65,28.1
NT-RX  (via drill 0.33)
  Top 0.152: JP2.3 19.75,8.41 | IC1.52 12.2,18.92 12.86,18.26 13.33,18.26 v13.97,17.62
  Top 0.203: 19.75,8.41 18.89,8.41 18.41,8.89 v18.41,9.99 v18.41,10 18.9,10.48 21.27,10.48 21.59,10.79 21.59,11.59 21.43,11.75 21.43,14.76 20.61,15.58 JP3.3 18.28,15.58 v17.94,15.88 17.62,16.19 R7.1
  Bottom 0.152: v13.97,17.62 14.29,17.3 14.29,16.83 15.16,15.95 17.38,15.95 17.46,15.88 v17.94,15.88
  Bottom 0.203: JP4.5 18.63,9.77 v18.41,9.99
NT-TX  (via drill 0.33)
  Top 0.152: v13.18,17.62 13.02,17.78 12.7,17.78 11.7,18.78 IC1.51
  Top 0.203: R8.1 17.62,14.61 v17.94,14.92 18.31,14.58 JP3.2 20.66,14.58 20.95,14.29 v20.95,11.11 | JP2.2 20.61,7.44 v20.95,7.78
  Bottom 0.152: v17.94,14.92 17.3,15.56 14.92,15.56 13.49,16.99 13.49,17.3 v13.18,17.62
  Bottom 0.203: v20.95,11.11 20.95,10.76 | 20.95,10.76 v20.95,7.78 | 20.95,10.76 19.73,10.76 JP4.4
POT0
  Top 0.152: IC1.26 13.7,31.79 14.29,32.38 14.29,32.86 13.81,33.34 12.86,33.34 12.22,33.97 12.22,34.76 JP5.4
POT1
  Top 0.152: IC1.25 14.2,31.82 14.6,32.23 14.6,33.02 13.97,33.66 13.49,33.66 13.18,33.97 JP5.3
RC0/RX1
  Top 0.152: PH2.2 4.29,30.16 7.3,27.15 IC1.37 9.68,27.15 10.16,26.67 10.16,25.08 9.73,24.65 IC1.42
RC1/TX1
  Top 0.152: PH2.3 4.6,26.99 6.83,26.99 7.16,26.65 IC1.38 9.54,26.65 9.84,26.35 9.84,25.4 9.59,25.15 IC1.41
RC2
  Top 0.152: PH4.1 2.7,23.81 4.92,23.81 7.26,26.15 IC1.39
RC2-0
  Top 0.152: PH4.2 2.86,21.11 4.76,21.11 5.4,21.75 5.4,23.81 7.23,25.65 IC1.40
RX2
  Top 0.152: PH5.2 19.76,37.31 19.76,35.32 20,35.08 20,33.18 19.61,32.78 19.61,31.83 19.21,31.43 18.41,31.43 18.2,31.21 IC1.17
RX5  (via drill 0.33)
  Top 0.152: v5.87,27.62 5.87,27.78 4.76,28.89 2.7,28.89 PH3.2 | IC1.54 13.2,20.93 v13.18,20.95
  Bottom 0.152: v5.87,27.62 5.87,27.15 5.4,26.67 5.4,26.04 6.03,25.4 6.03,24.13 9.13,21.03 11.35,21.03 12.06,20.32 12.54,20.32 v13.18,20.95
SCK3  (via drill 0.33)
  Top 0.152: v14.45,25.4 13.89,24.84 13.89,20.8 13.7,20.6 IC1.55
  Bottom 0.152: IC4.13 16.19,24.92 16.03,24.77 15.4,24.77 14.76,25.4 v14.45,25.4
SD-CS  (via drill 0.33)
  Top 0.152: IC1.36 9.97,27.65 10.79,26.83 v10.79,26.51
  Bottom 0.152: 8.89,25.24 8.84,25.19 JP7.2 9.63,25.19 10.79,26.35 v10.79,26.51
SD-DETECT  (via drill 0.33)
  Top 0.152: IC1.50 11.2,21.52 11.75,22.07 v11.75,23.34
  Bottom 0.152: JP7.G3 11.76,23.32 v11.75,23.34
SD-MISO  (via drill 0.33)
  Top 0.152: IC1.22 15.7,32.09 v15.56,32.23
  Bottom 0.152: JP7.7 9,30.69 9.05,30.8 15.24,30.8 15.56,31.11 | v15.56,32.23 15.56,31.11 | 15.56,31.11 16.67,30 R11.2
SD-MOSI  (via drill 0.33)
  Top 0.152: v13.49,27.78 15.2,29.48 IC1.23
  Bottom 0.152: JP7.3 9.14,26.29 10.79,27.94 12.54,27.94 12.7,27.78 v13.49,27.78
SD-SCK  (via drill 0.33)
  Top 0.152: IC1.21 16.2,29.05 v15.64,28.5
  Bottom 0.152: v15.64,28.5 15.24,28.89 10.48,28.89 10.07,28.49 JP7.5
SWCLK  (via drill 0.33)
  Top 0.152: v10.16,19.84 10.64,19.84 10.68,19.8 10.68,19.68 IC1.49
  Bottom 0.152: PH1.2 3.81,20.32 5.71,20.32 6.35,19.68 7.3,19.68 7.46,19.53 9.84,19.53 v10.16,19.84
SWDIO  (via drill 0.33)
  Top 0.152: IC1.45 7.75,23.15 7.14,22.54 7.14,19.21 v7.46,18.89
  Bottom 0.152: PH1.4 6.98,19.37 v7.46,18.89
TX2  (via drill 0.33)
  Top 0.152: v20.8,34.45 21.59,33.66 21.59,29.69 21.05,29.15 IC1.16
  Bottom 0.152: v20.8,34.45 20.64,34.45 19.76,35.32 19.76,37.31 PH5.3
TX5  (via drill 0.33)
  Top 0.152: PH3.3 2.7,26.35 v6.03,26.35 | IC1.53 12.7,20.48 v12.22,20.95
  Bottom 0.152: v12.22,20.95 11.91,20.95 11.51,21.35 9.29,21.35 6.51,24.13 6.51,25.88 v6.03,26.35
TXCO-CLK
  Top 0.203: IC1.3 22.33,22.65 22.5,22.82 Q2.3
USB_DM
  Top 0.152: 7.78,12.18 7.78,12.38 8.49,13.1 8.49,16.11 6.51,18.1 6.51,23.02 7.64,24.15 IC1.43
  Top 0.203: JP1.B7 7.78,12.18 7.78,11.43 7.53,11.18 JP1.A7
USB_DP  (via drill 0.33)
  Top 0.152: v8.41,12.22 8.89,12.7 8.89,16.19 6.83,18.26 6.83,22.86 7.62,23.65 IC1.44
  Top 0.203: JP1.B6 5.83,10.68 5.56,10.95 5.56,11.27 | JP1.A6 5.81,11.68 5.56,11.43 5.56,11.27 | v5.4,11.27 5.56,11.27
  Bottom 0.152: v5.4,11.27 6.19,11.27 7.14,12.22 v8.41,12.22
VBAT  (via drill 0.33)
  Top 0.152: Q2.4 Q2.1
  Top 0.254: v21.27,20.8 21.27,20.95 20.58,21.65 IC1.1
  Top 0.305: Q2.4 21.79,21.32 v21.27,20.8
  Bottom 0.203: BAT1.P+ 17.19,16.87
  Bottom 0.254: C22.1 21.1,19.21 21.11,19.21 19.21,17.3 17.62,17.3 17.19,16.87
  Bottom 0.305: C22.1 v21.27,20.8
VCAP_1  (via drill 0.33)
  Top 0.203: IC1.30 11.7,28.79 12.22,28.26 12.22,25.88 10.32,23.97 10.32,23.18 9.79,22.65 IC1.46
  Top 0.305: v12.86,25.24 12.22,25.88
  Bottom 0.305: C26.1 14.11,23.99 v12.86,25.24
VCC  (via drill 0.5)
  Top 0.203: IC2.2 IC2.3
  Top 0.61: IC2.3 12.06,6.03 11.43,5.4 11.43,5.34 C2.1 11.27,5.29 11.49,5.29
  Top 0.914: 11.49,5.29 v12.06,5.87
  Bottom 0.152: 19.69,13.97 19.69,14.45 22.54,17.3 22.54,18.73 22.7,18.89 22.7,21.75 R5.1
  Bottom 0.203: 20.99,13.77 21.02,13.75 | 19.69,13.97 JP4.1
  Bottom 0.61: 21.02,13.75 21.83,12.94 21.83,7.38 21.11,6.67 14.92,6.67 14.29,6.03 13.33,6.03 D1.C 13.21,5.87 v12.06,5.87 | JP4.1 20.99,13.77 | C1.1 10.48,6.03 10.64,5.87
  Bottom 0.914: 10.64,5.87 v12.06,5.87
VUSB  (via drill 0.4)
  Top 0.152: JP1.VBUS1 6.26,13.88 | JP1.VBUS2 6.26,8.98
  Top 0.356: 6.26,13.88 5.56,13.18 | 6.26,8.98 v5.24,10
  Top 0.406: 5.56,13.18 4.6,12.22 4.6,10.64 5.08,10.16
  Top 1.016: v5.24,10 5.08,10.16
  Bottom 0.61: C21.1 3.03,9.06 3.33,9.37 3.33,10 | 3.33,10 3.33,10.58 C20.1 3.49,10.69 3.49,10.79 1.75,12.7 D3.A | v5.24,10 3.33,10

### Text on the board
tNames: Rd | Gr | GND | 3.3V | P0 | P1 | B | UART2 | G | ESP | Rx | R0 | Tx | R1 | R2 | 3.3 | R20 | 5V | SWD | G | v6.2 | R | T | 5V | GND | Rx | Tx | 5V | + | - | v6.2
bNames: AUX | www.OlliW.eu | by | A1 | GND | A0 | 5V | 3.3 | 5V | SWD | BL | + | BAT | GND | 5V | Tx | Rx | GND | v6.2 | rev 020 | + | -